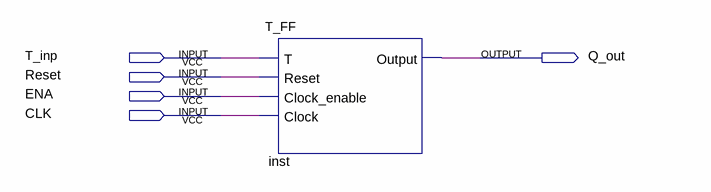
[diagram p0: schematic sheet]
// Quartus schematic Block1.bdf as structural Verilog: 1 symbols, 5 pins
module Block1 (
  input  T_inp,
  input  Reset,
  input  ENA,
  input  CLK,
  output Q_out
);

  T_FF inst (.T(T_inp), .Reset(Reset), .Clock_enable(ENA), .Clock(CLK), .Output(Q_out));
endmodule
